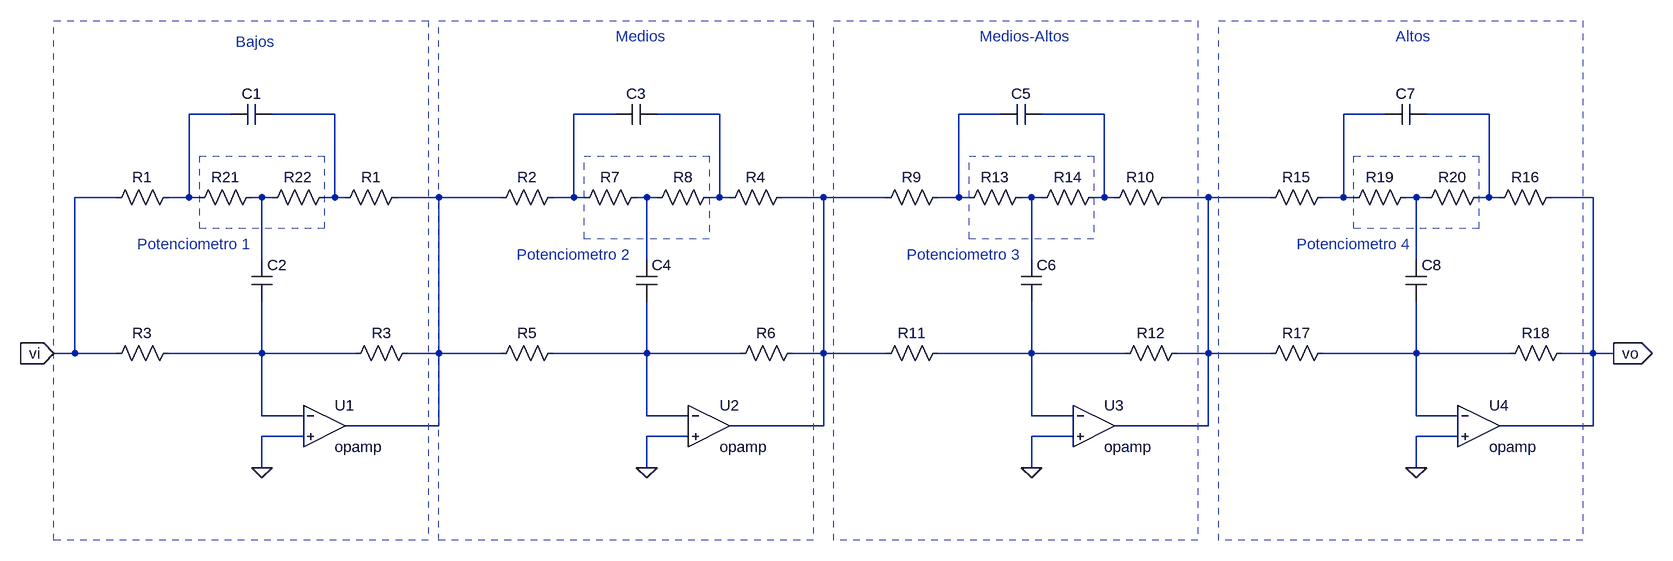
[diagram p0: schematic Draft1.asc]
Draft1.asc, the LTspice schematic file:
Version 4
SHEET 1 2328 708
WIRE 112 48 48 48
WIRE 272 48 176 48
WIRE 704 48 640 48
WIRE 864 48 768 48
WIRE 1296 48 1232 48
WIRE 1456 48 1360 48
WIRE 1888 48 1824 48
WIRE 2048 48 1952 48
WIRE -64 176 -128 176
WIRE 48 176 48 48
WIRE 48 176 16 176
WIRE 64 176 48 176
WIRE 160 176 144 176
WIRE 176 176 160 176
WIRE 272 176 272 48
WIRE 272 176 256 176
WIRE 288 176 272 176
WIRE 432 176 368 176
WIRE 528 176 432 176
WIRE 640 176 640 48
WIRE 640 176 608 176
WIRE 656 176 640 176
WIRE 752 176 736 176
WIRE 768 176 752 176
WIRE 864 176 864 48
WIRE 864 176 848 176
WIRE 880 176 864 176
WIRE 1024 176 960 176
WIRE 1120 176 1024 176
WIRE 1232 176 1232 48
WIRE 1232 176 1200 176
WIRE 1248 176 1232 176
WIRE 1344 176 1328 176
WIRE 1360 176 1344 176
WIRE 1456 176 1456 48
WIRE 1456 176 1440 176
WIRE 1472 176 1456 176
WIRE 1616 176 1552 176
WIRE 1712 176 1616 176
WIRE 1824 176 1824 48
WIRE 1824 176 1792 176
WIRE 1840 176 1824 176
WIRE 1936 176 1920 176
WIRE 1952 176 1936 176
WIRE 2048 176 2048 48
WIRE 2048 176 2032 176
WIRE 2064 176 2048 176
WIRE 2208 176 2144 176
WIRE 160 272 160 176
WIRE 752 272 752 176
WIRE 1344 272 1344 176
WIRE 1936 272 1936 176
WIRE -128 416 -128 176
WIRE -128 416 -160 416
WIRE -64 416 -128 416
WIRE 160 416 160 336
WIRE 160 416 16 416
WIRE 304 416 160 416
WIRE 432 416 432 176
WIRE 432 416 384 416
WIRE 528 416 432 416
WIRE 752 416 752 336
WIRE 752 416 608 416
WIRE 896 416 752 416
WIRE 1024 416 1024 176
WIRE 1024 416 976 416
WIRE 1120 416 1024 416
WIRE 1344 416 1344 336
WIRE 1344 416 1200 416
WIRE 1488 416 1344 416
WIRE 1616 416 1616 176
WIRE 1616 416 1568 416
WIRE 1712 416 1616 416
WIRE 1936 416 1936 336
WIRE 1936 416 1792 416
WIRE 2080 416 1936 416
WIRE 2208 416 2208 176
WIRE 2208 416 2160 416
WIRE 2240 416 2208 416
WIRE 160 512 160 416
WIRE 224 512 160 512
WIRE 752 512 752 416
WIRE 816 512 752 512
WIRE 1344 512 1344 416
WIRE 1408 512 1344 512
WIRE 1936 512 1936 416
WIRE 2000 512 1936 512
WIRE 432 528 432 416
WIRE 432 528 288 528
WIRE 1024 528 1024 416
WIRE 1024 528 880 528
WIRE 1616 528 1616 416
WIRE 1616 528 1472 528
WIRE 2208 528 2208 416
WIRE 2208 528 2064 528
WIRE 224 544 160 544
WIRE 816 544 752 544
WIRE 1408 544 1344 544
WIRE 2000 544 1936 544
WIRE 160 592 160 544
WIRE 752 592 752 544
WIRE 1344 592 1344 544
WIRE 1936 592 1936 544
FLAG 160 592 0
FLAG 752 592 0
FLAG 1344 592 0
FLAG 1936 592 0
FLAG -160 416 vi
IOPIN -160 416 In
FLAG 2240 416 vo
IOPIN 2240 416 Out
SYMBOL res 32 160 R90
WINDOW 0 0 56 VBottom 2
WINDOW 3 32 56 VTop 2
SYMATTR InstName R1
SYMATTR Value ""
SYMBOL res 384 160 R90
WINDOW 0 0 56 VBottom 2
WINDOW 3 32 56 VTop 2
SYMATTR InstName R1
SYMATTR Value ""
SYMBOL res 32 400 R90
WINDOW 0 0 56 VBottom 2
WINDOW 3 32 56 VTop 2
SYMATTR InstName R3
SYMATTR Value ""
SYMBOL res 400 400 R90
WINDOW 0 0 56 VBottom 2
WINDOW 3 32 56 VTop 2
SYMATTR InstName R3
SYMATTR Value ""
SYMBOL cap 176 32 R90
WINDOW 0 0 32 VBottom 2
WINDOW 3 32 32 VTop 2
SYMATTR InstName C1
SYMATTR Value ""
SYMBOL cap 144 272 R0
SYMATTR InstName C2
SYMATTR Value ""
SYMBOL res 160 160 R90
WINDOW 0 0 56 VBottom 2
WINDOW 3 32 56 VTop 2
SYMATTR InstName R21
SYMATTR Value ""
SYMBOL res 272 160 R90
WINDOW 0 0 56 VBottom 2
WINDOW 3 32 56 VTop 2
SYMATTR InstName R22
SYMATTR Value ""
SYMBOL Opamps\\opamp 256 464 R0
SYMATTR InstName U1
SYMBOL res 624 160 R90
WINDOW 0 0 56 VBottom 2
WINDOW 3 32 56 VTop 2
SYMATTR InstName R2
SYMATTR Value ""
SYMBOL res 976 160 R90
WINDOW 0 0 56 VBottom 2
WINDOW 3 32 56 VTop 2
SYMATTR InstName R4
SYMATTR Value ""
SYMBOL res 624 400 R90
WINDOW 0 0 56 VBottom 2
WINDOW 3 32 56 VTop 2
SYMATTR InstName R5
SYMATTR Value ""
SYMBOL res 992 400 R90
WINDOW 0 0 56 VBottom 2
WINDOW 3 32 56 VTop 2
SYMATTR InstName R6
SYMATTR Value ""
SYMBOL cap 768 32 R90
WINDOW 0 0 32 VBottom 2
WINDOW 3 32 32 VTop 2
SYMATTR InstName C3
SYMATTR Value ""
SYMBOL cap 736 272 R0
SYMATTR InstName C4
SYMATTR Value ""
SYMBOL res 752 160 R90
WINDOW 0 0 56 VBottom 2
WINDOW 3 32 56 VTop 2
SYMATTR InstName R7
SYMATTR Value ""
SYMBOL res 864 160 R90
WINDOW 0 0 56 VBottom 2
WINDOW 3 32 56 VTop 2
SYMATTR InstName R8
SYMATTR Value ""
SYMBOL Opamps\\opamp 848 464 R0
SYMATTR InstName U2
SYMBOL res 1216 160 R90
WINDOW 0 0 56 VBottom 2
WINDOW 3 32 56 VTop 2
SYMATTR InstName R9
SYMATTR Value ""
SYMBOL res 1568 160 R90
WINDOW 0 0 56 VBottom 2
WINDOW 3 32 56 VTop 2
SYMATTR InstName R10
SYMATTR Value ""
SYMBOL res 1216 400 R90
WINDOW 0 0 56 VBottom 2
WINDOW 3 32 56 VTop 2
SYMATTR InstName R11
SYMATTR Value ""
SYMBOL res 1584 400 R90
WINDOW 0 0 56 VBottom 2
WINDOW 3 32 56 VTop 2
SYMATTR InstName R12
SYMATTR Value ""
SYMBOL cap 1360 32 R90
WINDOW 0 0 32 VBottom 2
WINDOW 3 32 32 VTop 2
SYMATTR InstName C5
SYMATTR Value ""
SYMBOL cap 1328 272 R0
SYMATTR InstName C6
SYMATTR Value ""
SYMBOL res 1344 160 R90
WINDOW 0 0 56 VBottom 2
WINDOW 3 32 56 VTop 2
SYMATTR InstName R13
SYMATTR Value ""
SYMBOL res 1456 160 R90
WINDOW 0 0 56 VBottom 2
WINDOW 3 32 56 VTop 2
SYMATTR InstName R14
SYMATTR Value ""
SYMBOL Opamps\\opamp 1440 464 R0
SYMATTR InstName U3
SYMBOL res 1808 160 R90
WINDOW 0 0 56 VBottom 2
WINDOW 3 32 56 VTop 2
SYMATTR InstName R15
SYMATTR Value ""
SYMBOL res 2160 160 R90
WINDOW 0 0 56 VBottom 2
WINDOW 3 32 56 VTop 2
SYMATTR InstName R16
SYMATTR Value ""
SYMBOL res 1808 400 R90
WINDOW 0 0 56 VBottom 2
WINDOW 3 32 56 VTop 2
SYMATTR InstName R17
SYMATTR Value ""
SYMBOL res 2176 400 R90
WINDOW 0 0 56 VBottom 2
WINDOW 3 32 56 VTop 2
SYMATTR InstName R18
SYMATTR Value ""
SYMBOL cap 1952 32 R90
WINDOW 0 0 32 VBottom 2
WINDOW 3 32 32 VTop 2
SYMATTR InstName C7
SYMATTR Value ""
SYMBOL cap 1920 272 R0
SYMATTR InstName C8
SYMATTR Value ""
SYMBOL res 1936 160 R90
WINDOW 0 0 56 VBottom 2
WINDOW 3 32 56 VTop 2
SYMATTR InstName R19
SYMATTR Value ""
SYMBOL res 2048 160 R90
WINDOW 0 0 56 VBottom 2
WINDOW 3 32 56 VTop 2
SYMATTR InstName R20
SYMATTR Value ""
SYMBOL Opamps\\opamp 2032 464 R0
SYMATTR InstName U4
TEXT 120 -64 Left 2 ;Bajos
TEXT 704 -72 Left 2 ;Medios
TEXT 1264 -72 Left 2 ;Medios-Altos
TEXT 1904 -72 Left 2 ;Altos
TEXT -32 248 Left 2 ;Potenciometro 1
TEXT 552 264 Left 2 ;Potenciometro 2
TEXT 1152 264 Left 2 ;Potenciometro 3
TEXT 1752 248 Left 2 ;Potenciometro 4
RECTANGLE Normal 416 704 -160 -96 2
RECTANGLE Normal 1008 704 432 -96 2
RECTANGLE Normal 1600 704 1040 -96 2
RECTANGLE Normal 2192 704 1632 -96 2
RECTANGLE Normal 256 224 64 112 2
RECTANGLE Normal 848 240 656 112 2
RECTANGLE Normal 1440 240 1248 112 2
RECTANGLE Normal 2032 224 1840 112 2

The netlist it stands for:
* Draft1.asc
R1 N001 vi
R1 N010 N002
R3 N016 vi
R3 N010 N016
C1 N002 N001
C2 N009 N016
R21 N009 N001
R22 N002 N009
XU1 N016 0 N010 opamp Aol=100K GBW=10Meg  ; pins invin noninvin out
R2 N003 N010
R4 N012 N004
R5 N017 N010
R6 N012 N017
C3 N004 N003
C4 N011 N017
R7 N011 N003
R8 N004 N011
XU2 N017 0 N012 opamp Aol=100K GBW=10Meg  ; pins invin noninvin out
R9 N005 N012
R10 N014 N006
R11 N018 N012
R12 N014 N018
C5 N006 N005
C6 N013 N018
R13 N013 N005
R14 N006 N013
XU3 N018 0 N014 opamp Aol=100K GBW=10Meg  ; pins invin noninvin out
R15 N007 N014
R16 vo N008
R17 N019 N014
R18 vo N019
C7 N008 N007
C8 N015 N019
R19 N015 N007
R20 N008 N015
XU4 N019 0 vo opamp Aol=100K GBW=10Meg  ; pins invin noninvin out
* Bajos
* Medios
* Medios-Altos
* Altos
* Potenciometro 1
* Potenciometro 2
* Potenciometro 3
* Potenciometro 4
.backanno
.end